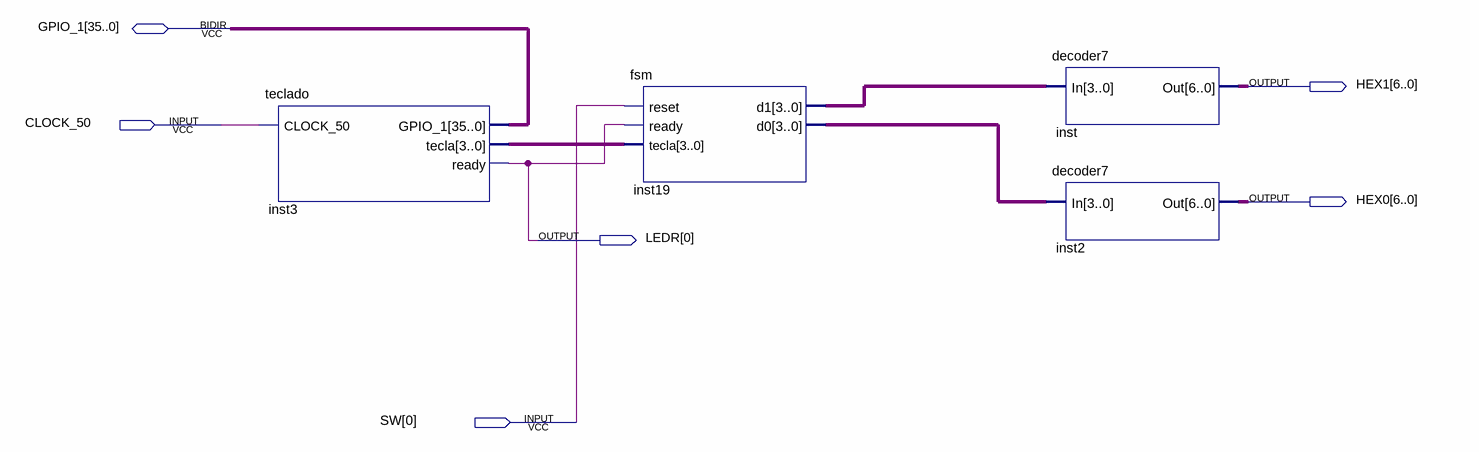
[diagram p0: schematic sheet]
// Quartus schematic top.bdf as structural Verilog: 4 symbols, 6 pins
module top (
  input  CLOCK_50,
  input  [0:0] SW,
  inout  [35:0] GPIO_1,
  output [6:0] HEX1,
  output [6:0] HEX0,
  output [0:0] LEDR
);

  wire [3:0] inst3_tecla, inst19_d0, inst19_d1;

  teclado inst3 (.CLOCK_50(CLOCK_50), .tecla(inst3_tecla), .ready(LEDR[0]), .GPIO_1(GPIO_1));
  fsm inst19 (.reset(SW[0]), .ready(LEDR[0]), .tecla(inst3_tecla), .d1(inst19_d1), .d0(inst19_d0));
  decoder7 inst (.In(inst19_d1), .Out(HEX1));
  decoder7 inst2 (.In(inst19_d0), .Out(HEX0));
endmodule
